# EAGLE schematic trill-ring (EAGLE 6.5.0)
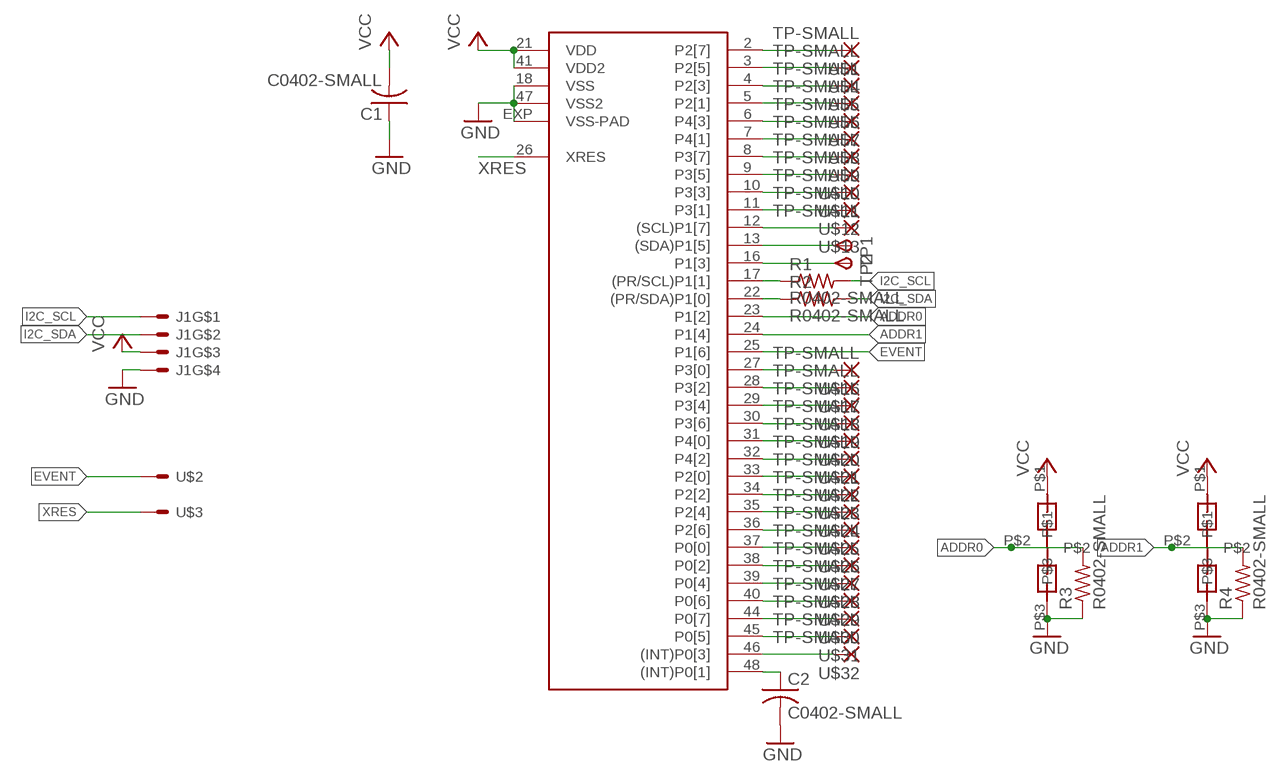
[diagram p0: schematic, sheet 1]

## Parts
C1  C0402-SMALL  [C0402-SMALL]
C2  C0402-SMALL  [C0402-SMALL]
IC1  CY8C206X6A  [QFN48-LEADS]
J1  GROVE-SMT  [JST-PH-4-SMT]
R1  R0402-SMALL  [C0402-SMALL]
R2  R0402-SMALL  [C0402-SMALL]
R3  R0402-SMALL  [C0402-SMALL]
R4  R0402-SMALL  [C0402-SMALL]
TP1  TPSTP20R  [TP20R]
TP2  TPSTP20R  [TP20R]
U$1  TP-SMALL  [TESTPAD-SMALL]
U$2  JST-SMT-EXTRAPAD  [JST-SMT-EXTRAPAD]
U$3  JST-SMT-EXTRAPAD  [JST-SMT-EXTRAPAD]
U$4  TP-SMALL  [TESTPAD-SMALL]
U$5  TP-SMALL  [TESTPAD-SMALL]
U$6  TP-SMALL  [TESTPAD-SMALL]
U$7  TP-SMALL  [TESTPAD-SMALL]
U$8  TP-SMALL  [TESTPAD-SMALL]
U$9  TP-SMALL  [TESTPAD-SMALL]
U$10  TP-SMALL  [TESTPAD-SMALL]
U$11  TP-SMALL  [TESTPAD-SMALL]
U$12  TP-SMALL  [TESTPAD-SMALL]
U$13  TP-SMALL  [TESTPAD-SMALL]
U$14  SOLDER_JUMPER_3PAD  [SOLDER_JUMPER_3PAD]
U$15  SOLDER_JUMPER_3PAD  [SOLDER_JUMPER_3PAD]
U$16  TP-SMALL  [TESTPAD-SMALL]
U$17  TP-SMALL  [TESTPAD-SMALL]
U$18  TP-SMALL  [TESTPAD-SMALL]
U$19  TP-SMALL  [TESTPAD-SMALL]
U$20  TP-SMALL  [TESTPAD-SMALL]
U$21  TP-SMALL  [TESTPAD-SMALL]
U$22  TP-SMALL  [TESTPAD-SMALL]
U$23  TP-SMALL  [TESTPAD-SMALL]
U$24  TP-SMALL  [TESTPAD-SMALL]
U$25  TP-SMALL  [TESTPAD-SMALL]
U$26  TP-SMALL  [TESTPAD-SMALL]
U$27  TP-SMALL  [TESTPAD-SMALL]
U$28  TP-SMALL  [TESTPAD-SMALL]
U$29  TP-SMALL  [TESTPAD-SMALL]
U$30  TP-SMALL  [TESTPAD-SMALL]
U$31  TP-SMALL  [TESTPAD-SMALL]
U$32  TP-SMALL  [TESTPAD-SMALL]

## Nets
ADDR0: IC1.23(P1[2]) R3.P$2 U$14.P$2
ADDR1: IC1.24(P1[4]) R4.P$2 U$15.P$2
EVENT: IC1.25(P1[6]) U$2.P$1(S)
GND: C1.P$1 C2.P$2 IC1.18(VSS) IC1.47(VSS2) IC1.EXP(VSS-PAD) J1.4 R3.P$1 R4.P$1 U$14.P$3 U$15.P$3
I2C_SCL: J1.1 R1.P$2
I2C_SDA: J1.2 R2.P$2
N$3: C2.P$1 IC1.48((INT)P0[1])
N$71Z1Z1O1K1: IC1.17((PR/SCL)P1[1]) R1.P$1
N$72Z1Z1O1K1: IC1.22((PR/SDA)P1[0]) R2.P$1
SENSOR1: IC1.2(P2[7]) U$1.P$1(P)
SENSOR2: IC1.3(P2[5]) U$4.P$1(P)
SENSOR3: IC1.4(P2[3]) U$5.P$1(P)
SENSOR4: IC1.5(P2[1]) U$6.P$1(P)
SENSOR5: IC1.6(P4[3]) U$7.P$1(P)
SENSOR6: IC1.7(P4[1]) U$8.P$1(P)
SENSOR7: IC1.8(P3[7]) U$9.P$1(P)
SENSOR8: IC1.9(P3[5]) U$10.P$1(P)
SENSOR9: IC1.10(P3[3]) U$11.P$1(P)
SENSOR10: IC1.11(P3[1]) U$12.P$1(P)
SENSOR11: IC1.12((SCL)P1[7]) U$13.P$1(P)
SENSOR12: IC1.13((SDA)P1[5]) TP1.TP(PP)
SENSOR13: IC1.16(P1[3]) TP2.TP(PP)
SENSOR14: IC1.27(P3[0]) U$16.P$1(P)
SENSOR15: IC1.28(P3[2]) U$17.P$1(P)
SENSOR16: IC1.29(P3[4]) U$18.P$1(P)
SENSOR17: IC1.30(P3[6]) U$19.P$1(P)
SENSOR18: IC1.31(P4[0]) U$20.P$1(P)
SENSOR19: IC1.32(P4[2]) U$21.P$1(P)
SENSOR20: IC1.33(P2[0]) U$22.P$1(P)
SENSOR21: IC1.34(P2[2]) U$23.P$1(P)
SENSOR22: IC1.35(P2[4]) U$24.P$1(P)
SENSOR23: IC1.36(P2[6]) U$25.P$1(P)
SENSOR24: IC1.37(P0[0]) U$26.P$1(P)
SENSOR25: IC1.38(P0[2]) U$27.P$1(P)
SENSOR26: IC1.39(P0[4]) U$28.P$1(P)
SENSOR27: IC1.40(P0[6]) U$29.P$1(P)
SENSOR28: IC1.44(P0[7]) U$30.P$1(P)
SENSOR29: IC1.45(P0[5]) U$31.P$1(P)
SENSOR30: IC1.46((INT)P0[3]) U$32.P$1(P)
VCC: C1.P$2 IC1.21(VDD) IC1.41(VDD2) J1.3 U$14.P$1 U$15.P$1
XRES: IC1.26(XRES) U$3.P$1(S)

## Library data of the parts
C1 C2 = custom:C0402-SMALL
IC1 = custom:CY8C206X6A
J1 = custom:GROVE-SMT
R1-R4 = custom:R0402-SMALL
TP1 TP2 = testpad:TPS: TEST PIN
U$1 U$4-U$13 U$16-U$32 = custom:TP-SMALL
U$2 U$3 = custom:JST-SMT-EXTRAPAD
U$14 U$15 = custom:SOLDER_JUMPER_3PAD